# Altium schematic sheet PC104_52-52.SchDoc
size 420 x 297 mm; SheetNumber: 8; SheetTotal: 13
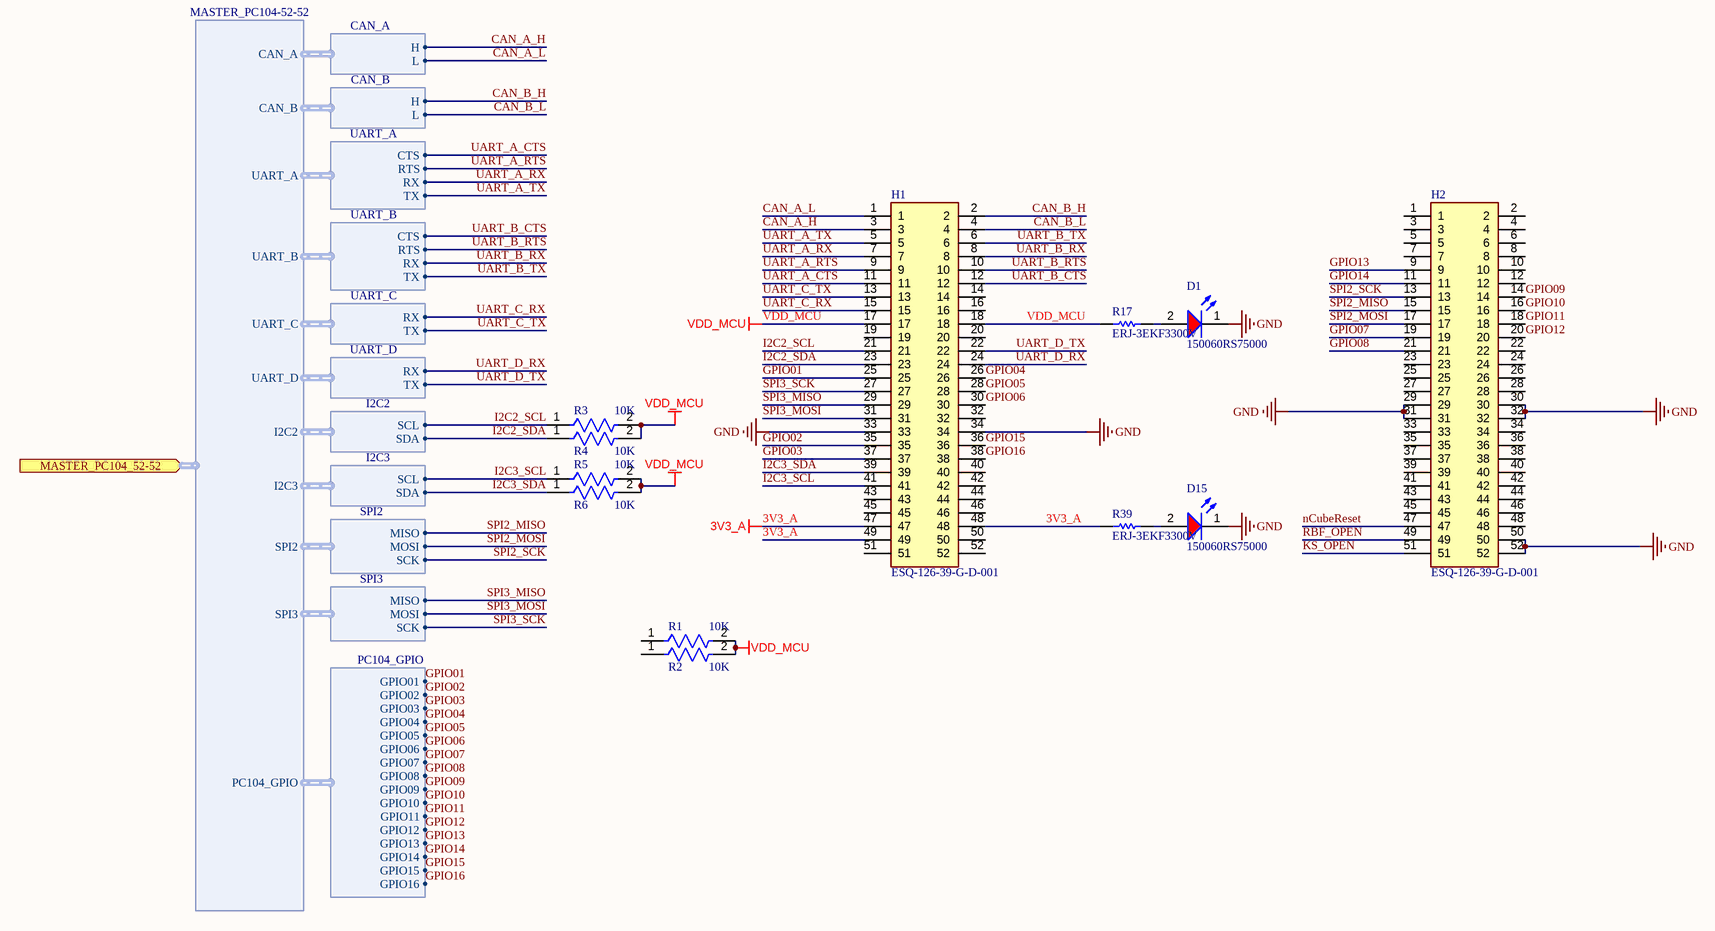
[diagram p0: PC104_52-52.SchDoc]

## Parts
D1  150060RS75000  [WL-SMCW_0603_150060xx75000]
D15  150060RS75000  [WL-SMCW_0603_150060xx75000]
H1  ESQ-126-39-G-D-001  [RHDR52W64P254_2X26_6654X495X1135P]
H2  ESQ-126-39-G-D-001  [RHDR52W64P254_2X26_6654X495X1135P]
R1  10K  [FP-RK73B1J-MFG]
R2  10K  [FP-RK73B1J-MFG]
R3  10K  [FP-RK73B1J-MFG]
R4  10K  [FP-RK73B1J-MFG]
R5  10K  [FP-RK73B1J-MFG]
R6  10K  [FP-RK73B1J-MFG]
R17  ERJ-3EKF3300V  [RESC1608X55X30LL15T15]
R39  ERJ-3EKF3300V  [RESC1608X55X30LL15T15]

## Ports
MASTER_PC104_52-52 (in, harness MASTER_PC104-52-52)

## Harnesses
MASTER_PC104-52-52: CAN_A, CAN_B, UART_A, UART_B, UART_C, UART_D, I2C2, I2C3, SPI3, SPI2, PC104_GPIO
I2C2: SDA, SCL
I2C3: SDA, SCL
UART_C: TX, RX
UART_D: TX, RX
UART_A: TX, RX, RTS, CTS
UART_B: TX, RX, RTS, CTS
CAN_A: L, H
CAN_B: L, H
SPI2: MOSI, MISO, SCK
SPI3: MISO, SCK, MOSI
PC104_GPIO: GPIO01, GPIO02, GPIO03, GPIO04, GPIO05, GPIO06, GPIO07, GPIO08, GPIO09, GPIO10, GPIO11, GPIO12, GPIO13, GPIO14, GPIO15, GPIO16

## Nets
3V3_A: H1.47 H1.48 H1.49 R39.1
GND: D1.1(K) D15.1(K) H1.33 H1.34 H2.29 H2.30 H2.31 H2.32 H2.50 H2.52
VDD_MCU: H1.17 H1.18 R1.2 R2.2 R3.2 R4.2 R5.2 R6.2 R17.1
CAN_A_H: H1.3 ; harness CAN_A.H
CAN_A_L: H1.1 ; harness CAN_A.L
CAN_B_H: H1.2 ; harness CAN_B.H
CAN_B_L: H1.4 ; harness CAN_B.L
GPIO01: H1.25 ; harness PC104_GPIO.GPIO01
GPIO02: H1.35 ; harness PC104_GPIO.GPIO02
GPIO03: H1.37 ; harness PC104_GPIO.GPIO03
GPIO04: H1.26 ; harness PC104_GPIO.GPIO04
GPIO05: H1.28 ; harness PC104_GPIO.GPIO05
GPIO06: H1.30 ; harness PC104_GPIO.GPIO06
GPIO07: H2.19 ; harness PC104_GPIO.GPIO07
GPIO08: H2.21 ; harness PC104_GPIO.GPIO08
GPIO09: H2.14 ; harness PC104_GPIO.GPIO09
GPIO10: H2.16 ; harness PC104_GPIO.GPIO10
GPIO11: H2.18 ; harness PC104_GPIO.GPIO11
GPIO12: H2.20 ; harness PC104_GPIO.GPIO12
GPIO13: H2.9 ; harness PC104_GPIO.GPIO13
GPIO14: H2.11 ; harness PC104_GPIO.GPIO14
GPIO15: H1.36 ; harness PC104_GPIO.GPIO15
GPIO16: H1.38 ; harness PC104_GPIO.GPIO16
I2C2_SCL: H1.21 R3.1 ; harness I2C2.SCL
I2C2_SDA: H1.23 R4.1 ; harness I2C2.SDA
I2C3_SCL: H1.41 R5.1 ; harness I2C3.SCL
I2C3_SDA: H1.39 R6.1 ; harness I2C3.SDA
KS_OPEN: H2.51
nCubeReset: H2.47
RBF_OPEN: H2.49
SPI2_MISO: H2.15 ; harness SPI2.MISO
SPI2_MOSI: H2.17 ; harness SPI2.MOSI
SPI2_SCK: H2.13 ; harness SPI2.SCK
SPI3_MISO: H1.29 ; harness SPI3.MISO
SPI3_MOSI: H1.31 ; harness SPI3.MOSI
SPI3_SCK: H1.27 ; harness SPI3.SCK
UART_A_CTS: H1.11 ; harness UART_A.CTS
UART_A_RTS: H1.9 ; harness UART_A.RTS
UART_A_RX: H1.7 ; harness UART_A.RX
UART_A_TX: H1.5 ; harness UART_A.TX
UART_B_CTS: H1.12 ; harness UART_B.CTS
UART_B_RTS: H1.10 ; harness UART_B.RTS
UART_B_RX: H1.8 ; harness UART_B.RX
UART_B_TX: H1.6 ; harness UART_B.TX
UART_C_RX: H1.15 ; harness UART_C.RX
UART_C_TX: H1.13 ; harness UART_C.TX
UART_D_RX: H1.24 ; harness UART_D.RX
UART_D_TX: H1.22 ; harness UART_D.TX
NetD1_2: D1.2(A) R17.2
NetD15_2: D15.2(A) R39.2

Not connected (* = marked no-connect by the designer): H1 14 16 19 20 32 40 42 43 44 45 46 50 51 52; H2 1 2 3 4 5 6 7 8 10 12 22 23 24 25 26 27 28 33 34 35 36 37 38 39 40 41 42 43 44 45 46 48; R1 1; R2 1

## Notes on the sheet
- THIS DOCUMENT AND THE DATA DISCLOSED HEREIN OR
- HEREWITH IS THE PROPERTY OF ALTIUM LIMITED AND MAY
- DWG NO:
- REVISION
- REV:
- DESCRIPTION
- DATE
- APPROVED
- BE FREELY DISTRIBUTED IN WHOLE. NO RIGHTS ARE
- RESERVED OR EXPRESS OR IMPLIED WARANTEE GIVEN.
- ENG:
- APPROVALS
- PROJECT
- DSN:
- CHK:
- REFERENCE DOCUMENTS
- PROJECT REVISION:
- TITLE
- DOCUMENT REVISION:
- DESIGN ITEM:
- BOM:
- FAB DWG:
- PCB DWG:
- ASSY DWG:
- SCALE:
- A3
- SIZE
- CAGE CODE
- FILE NAME
- DWG NO.
- SHEET
- OF
- REV

## Library data of the parts
D1 D15 = CMP-1426-00001-4: LED Low-Power Uni-Color Red 630nm 2V 2-Pin Chip 0603(1608Metric) T/R; Max Junction Temperature (Tj): 95°C; Dominant Wavelength: 625nm; Lens Style: Clear, Rectangular; Viewing Angle: 140°; Forward Current: 100mA; Max Reverse Voltage (DC): 5V; Luminous Intensity: 250mcd; Test Current: 20mA; Power Dissipation: 72mW; Max Operating Temperature: 85°C; Mount: Surface Mount; Height: 700µm; Packaging: Tape and Reel; REACH SVHC: Unknown; Case Code (Metric): 1608; Peak Wavelength: 630nm; Forward Voltage: 2V; Case/Package: 0603; Color: Red; RoHS: Compliant; Width: 800µm; Reverse Voltage: 5V; Min Operating Temperature: -40°C; Wavelength: 625nm; Case Code (Imperial): 0603; Length: 1.6mm
H1 H2 = CMP-002-00086-1: PC / 104 Connectors Elevated Socket Strip; Manufacturer_Name: SAMTEC; Design Item ID: ESQ-126-39-G-D-001; Mouser Price/Stock: https://www.mouser.co.uk/ProductDetail/Samtec/ESQ-126-39-G-D-001?qs=PB6%2FjmICvI2K%2FCIgL4SVbg%3D%3D; Mouser Part Number: 200-ESQ12639GD001; Source: SamacSys.SchLib; Arrow Price/Stock: https://www.arrow.com/en/products/esq-126-39-g-d-001/samtec?region=nac; Arrow Part Number: ESQ-126-39-G-D-001; Manufacturer_Part_Number: ESQ-126-39-G-D-001; Datasheet Link: http://suddendocs.samtec.com/catalog_english/esq_th.pdf; Height: 11.35mm
R1-R6 = CMP-2000-01851-2: RES 10K OHM 5% 1/10W 0603; Temperature Coefficient: 200ppm/°C; Voltage Rating: 50V; Power Rating: 100mW; Resistance: 10kR; Length: 1.6mm; Lead Free: Lead Free; Resistance Tolerance: 5%; Case Code (Metric): 1608; Width: 0.8mm; Height: 0.45mm; Max Operating Temperature: 155°C; RoHS Compliant: Yes; Resistor Type: Thick Film; Min Operating Temperature: -55°C; Case Code (Imperial): 0603; Technology: THICK FILM; Package Quantity: 5000; Tolerance: 5%; Case/Package: 0603; Voltage Rating (DC): 50V; Depth: 0.8mm; Packaging: Tape and Reel; Number of Pins: 2; Construction: Rectangular; Series: RK73B; Military Standard: Not; Termination: SMD/SMT
R17 R39 = CMP-2000-00435-2: Chip Resistor, 330 Ohm, +/- 1%, 0.1 W, -55 to 155 degC, 0603 (1608 Metric), RoHS, Tape and Reel; Gender: Male; Mating Cycles: 10000; Current Rating: 500 mA; Voltage Rating: 10 V; REACH SVHC: No SVHC; PackageDescription: 2-Pin Surface Mount Device, Body 1.6 x 0.85 mm; Contact Finish: Gold; Pins: 8; ComponentLink1Description: Manufacturer URL; Packaging: Tape and Reel; Max Operating Temperature: 85 degC; Contact Material: Copper; Height: 1.45 mm; Width: 1.45 mm; DatasheetVersion: Apr-15; Package Quantity: 1500; Contact Plating: Gold; PackageReference: 0603; Mount: Surface Mount; Lead Pitch: 1.1 mm; Min Operating Temperature: -25 degC; ComponentLink1URL: http://www.panasonic.com/; ComponentLink2URL: http://industrial.panasonic.com/cdbs/www-data/pdf/RDA0000/AOA0000C86.pdf; Length: 13.7 mm; ComponentLink2Description: Datasheet; RoHSCompliant: true